# EasyEDA Pro project ch340gv1.eprj

# Schematic CH340GV1
Create Date: 2023-11-12; Page Name: CH340GV1; Project Name: ch340gv1; Schematic Name: CH340GV1; Update Date: 2023-11-13; Company: 嘉立创EDA; Page Size: A4; Version: V1.0
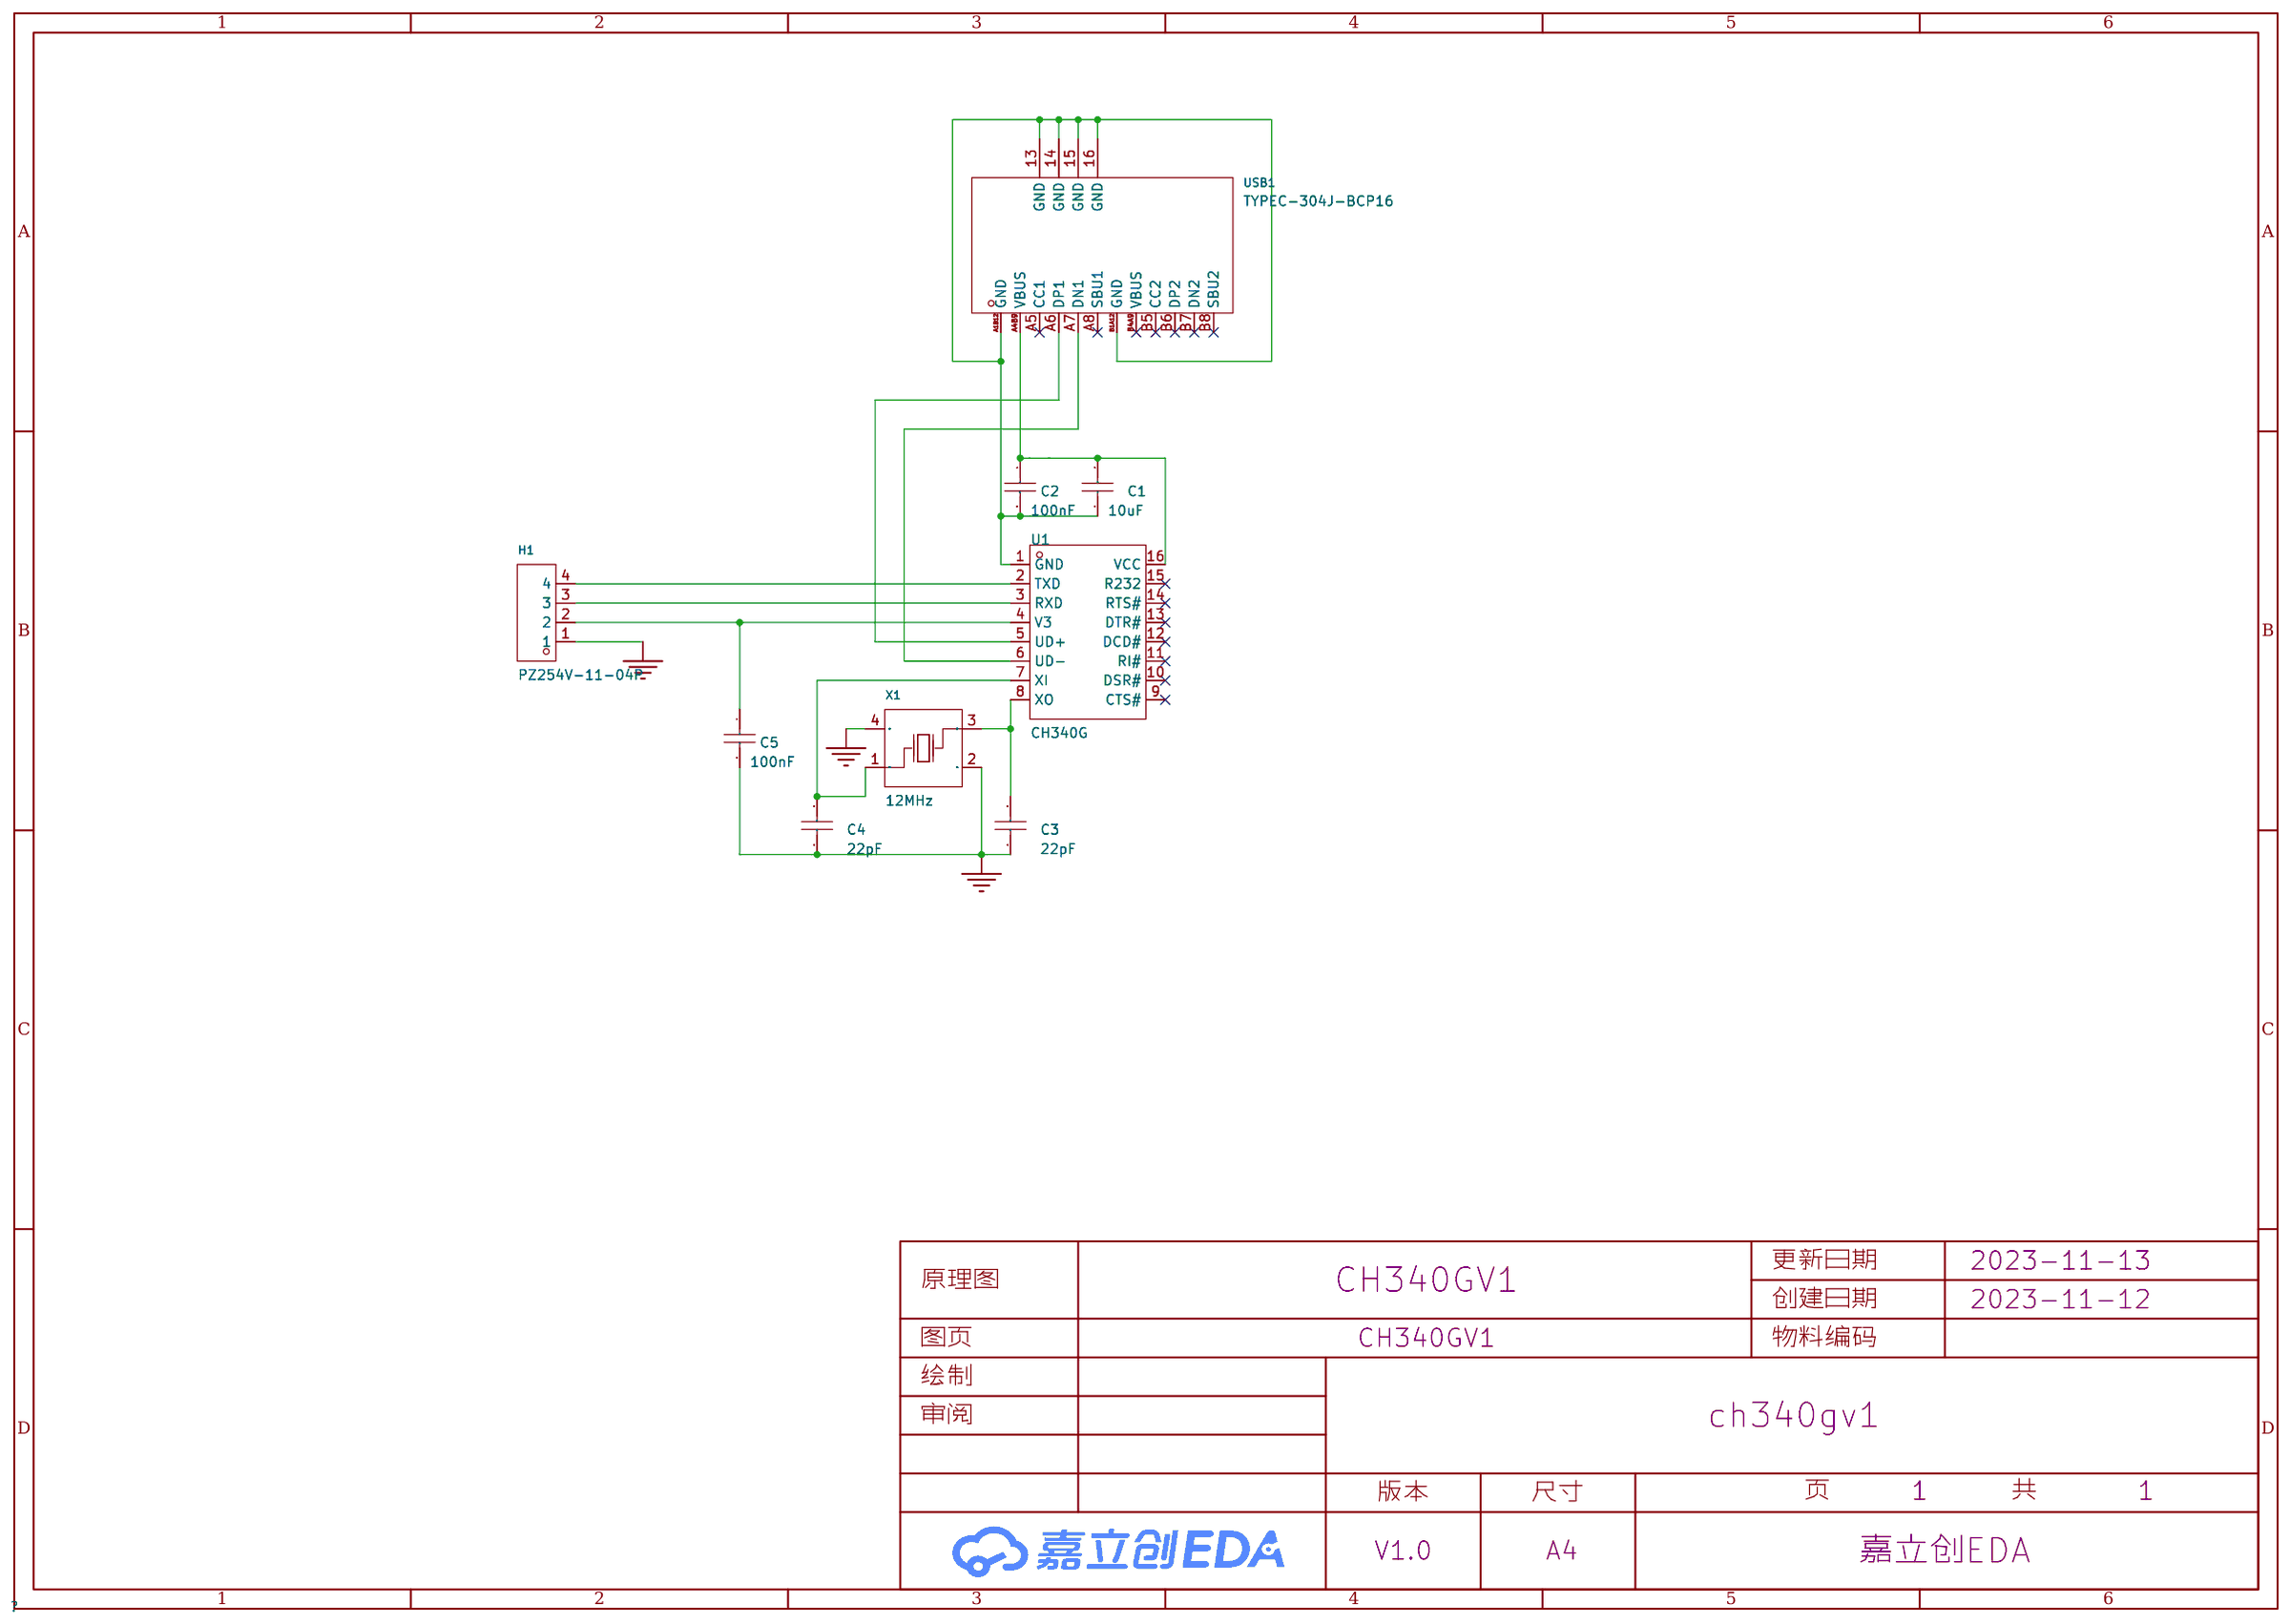
[diagram p0: schematic sheet]

## Parts
C1  10uF  [C1206]
C2  100nF  [C0603]
C3  22pF  [C0603]
C4  22pF  [C0603]
C5  100nF  [C0603]
H1  PZ254V-11-04P  [HDR-TH_4P-P2.54-V-M]
U1  CH340G  [SOIC-16_L9.9-W3.9-P1.27-LS6.0-BL]
USB1  TYPEC-304J-BCP16  [USB-C-SMD_TYPEC-304J-BCP16]
X1  12MHz  [CRYSTAL-SMD_4P-L3.2-W2.5-BL]

## Library data of the parts
C1 = CL31A106KBHNNNE: 容值:10uF;精度:±10%;额定电压:50V;材质(温度系数):X5R;; LCSC Part Name: 10uF ±10% 50V; Supplier Part: C13585; Manufacturer: SAMSUNG(三星); Supplier Footprint: 1206; JLCPCB Part Class: 基础库; Datasheet: https://atta.szlcsc.com/upload/public/pdf/source/20160103/1457707668742.pdf; Supplier: LCSC; Tolerance: ±10%; Voltage Rated: 50V; Temperature Coefficient: X5R
C2 C5 = 0603B104K500NT: 容值:100nF;精度:±10%;额定电压:50V;材质(温度系数):X7R;; LCSC Part Name: 100nF ±10% 50V; Supplier Part: C30926; Manufacturer: FH(风华); Supplier Footprint: 0603; JLCPCB Part Class: 扩展库; Datasheet: https://atta.szlcsc.com/upload/public/pdf/source/20170923/C30926_1506149436298988724.pdf; Supplier: LCSC; Tolerance: ±10%; Voltage Rated: 50V; Temperature Coefficient: X7R
C3 C4 = CC0603JRNPO9BN220: 容值:22pF;精度:±5%;额定电压:50V;材质(温度系数):NP0;; LCSC Part Name: 22pF ±5% 50V; Supplier Part: C105620; Manufacturer: YAGEO(国巨); Supplier Footprint: 0603; JLCPCB Part Class: 扩展库; Datasheet: https://atta.szlcsc.com/upload/public/pdf/source/20170425/1493115771353.pdf; Supplier: LCSC; Tolerance: ±5%; Voltage Rated: 50V; Temperature Coefficient: NP0
H1 = PZ254V-11-04P: 排数:单排;总PIN位数:4P;间距:2.54mm;插针结构:1x4P;行距:-;安装类型:直插;圆针/方针:方针;额定电流:3A;额定电压:250V;配合针长度:6mm;塑高:2.5mm;端接针长度:3mm;触头材质:-;工作温度范围:-40℃~+105℃;颜色:黑色;; LCSC Part Name: 2.54mm 1x4P 直插 方针; Supplier Part: C2691448; Manufacturer: XFCN(兴飞); Supplier Footprint: 插件,P=2.54mm; JLCPCB Part Class: 扩展库; Datasheet: https://atta.szlcsc.com/upload/public/pdf/source/20200309/C492403_F9F19131791D08044AD4F84F8E751A34.pdf; Supplier: LCSC; Number of Rows: 单排; Number of Pins: 4P; Pitch: 2.54mm; Pin Structure: 1x4P; Mounting Type: 直插; Circluar Pins/Square Pins: 方针; Current Rating (Max): 3A; Voltage Rating (Max): 250V; Length of Mating Pin: 6mm; Insulation Height: 2.5mm; Length of End Connection Pin: 3mm; Operating Temperature Range: -40℃~+105℃; Color: 黑色
U1 = CH340G: 应用功能:收发器;接口协议:USB 2.0;数据速率:2Mbps;; LCSC Part Name: USB转串口芯片 CH340; Supplier Part: C14267; Manufacturer: WCH(南京沁恒); Supplier Footprint: SOP-16; JLCPCB Part Class: 扩展库; Datasheet: https://atta.szlcsc.com/upload/public/pdf/source/20230530/6E401E9554E9F5311886CC8B3F89B62E.pdf; Supplier: LCSC; Applications Function: 收发器; Protocol: USB 2.0; Data Rate: 2Mbps; Supply Voltage: 3.3V；5V
USB1 = TYPEC-304J-BCP16: 连接器类型:Type-C;标准:USB 3.1;公母:母座;触点数量:16;端口数量:1;安装方式:卧贴;额定电流 - 电源:5A;工作温度范围:-40℃~+85℃;焊接温度(最大值):260℃;; LCSC Part Name: Type-C 母座 卧贴 脚长2.0; Supplier Part: C2835315; Manufacturer: XUNPU(讯普); Supplier Footprint: SMD,8.94x7.35x3.16mm; JLCPCB Part Class: 扩展库; Supplier: LCSC; Connector Type: Type-C; Standard: USB 3.1; Gender: 母座; Number of Contacts: 16; Number of Ports: 1; Mounting Style: 卧贴; Current Rating - Power (Max): 5A; Operating Temperature Range: -40℃~+85℃; Welding Temperature (Max): 260℃
X1 = TAXM12M4RLBDDT2T: 频率:12MHz;频率公差:±10ppm;负载电容:20pF;; LCSC Part Name: 12MHz ±10ppm 20pF; Supplier Part: C133334; Manufacturer: TAE(雅晶鑫); Supplier Footprint: SMD3225-4P; JLCPCB Part Class: 扩展库; Datasheet: https://atta.szlcsc.com/upload/public/pdf/source/20210910/A862C74DCD1FE9853DDB17F72A491972.pdf; Supplier: LCSC; Crystal Type: 贴片无源晶振; Frequency Tolerance: ±10ppm; Frequency Stability: ±20ppm; Load Capacitance: 20pF; Equivalent Series Resistance (ESR): 50Ω; Operating Temperature: -30℃~+85℃

## Nets
GND: C3.2 C4.2 C5.2 H1.1 X1.2(GND) X1.4(GND)
$1N386: C1.2 C2.1 U1.16(VCC) USB1.A4B9(VBUS)
$1N793: C4.1 U1.7(XI) X1.1(OSC1)
$1N927: C3.1 U1.8(XO) X1.3(OSC2)
$1N1103: H1.4 U1.2(TXD)
$1N1106: H1.3 U1.3(RXD)
$1N1109: U1.5(UD+) USB1.A6(DP1)
$1N1115: U1.6(UD-) USB1.A7(DN1)
$1N1172: C5.1 H1.2 U1.4(V3)
$1N1524: C1.1 C2.2 U1.1(GND) USB1.13(GND) USB1.14(GND) USB1.15(GND) USB1.16(GND) USB1.A1B12(GND) USB1.B1A12(GND)

Not connected (* = marked no-connect by the designer): U1 9(CTS#)* 10(DSR#)* 11(RI#)* 12(DCD#)* 13(DTR#)* 14(RTS#)* 15(R232)*; USB1 A5(CC1)* A8(SBU1)* B4A9(VBUS)* B5(CC2)* B6(DP2)* B7(DN2)* B8(SBU2)*

# Schematic CH340G2
Create Date: 2023-12-14; Page Name: CH340G2; Project Name: ch340gv1; Schematic Name: CH340G2; Update Date: 2023-12-15; Company: 嘉立创EDA; Page Size: A4; Version: V1.0
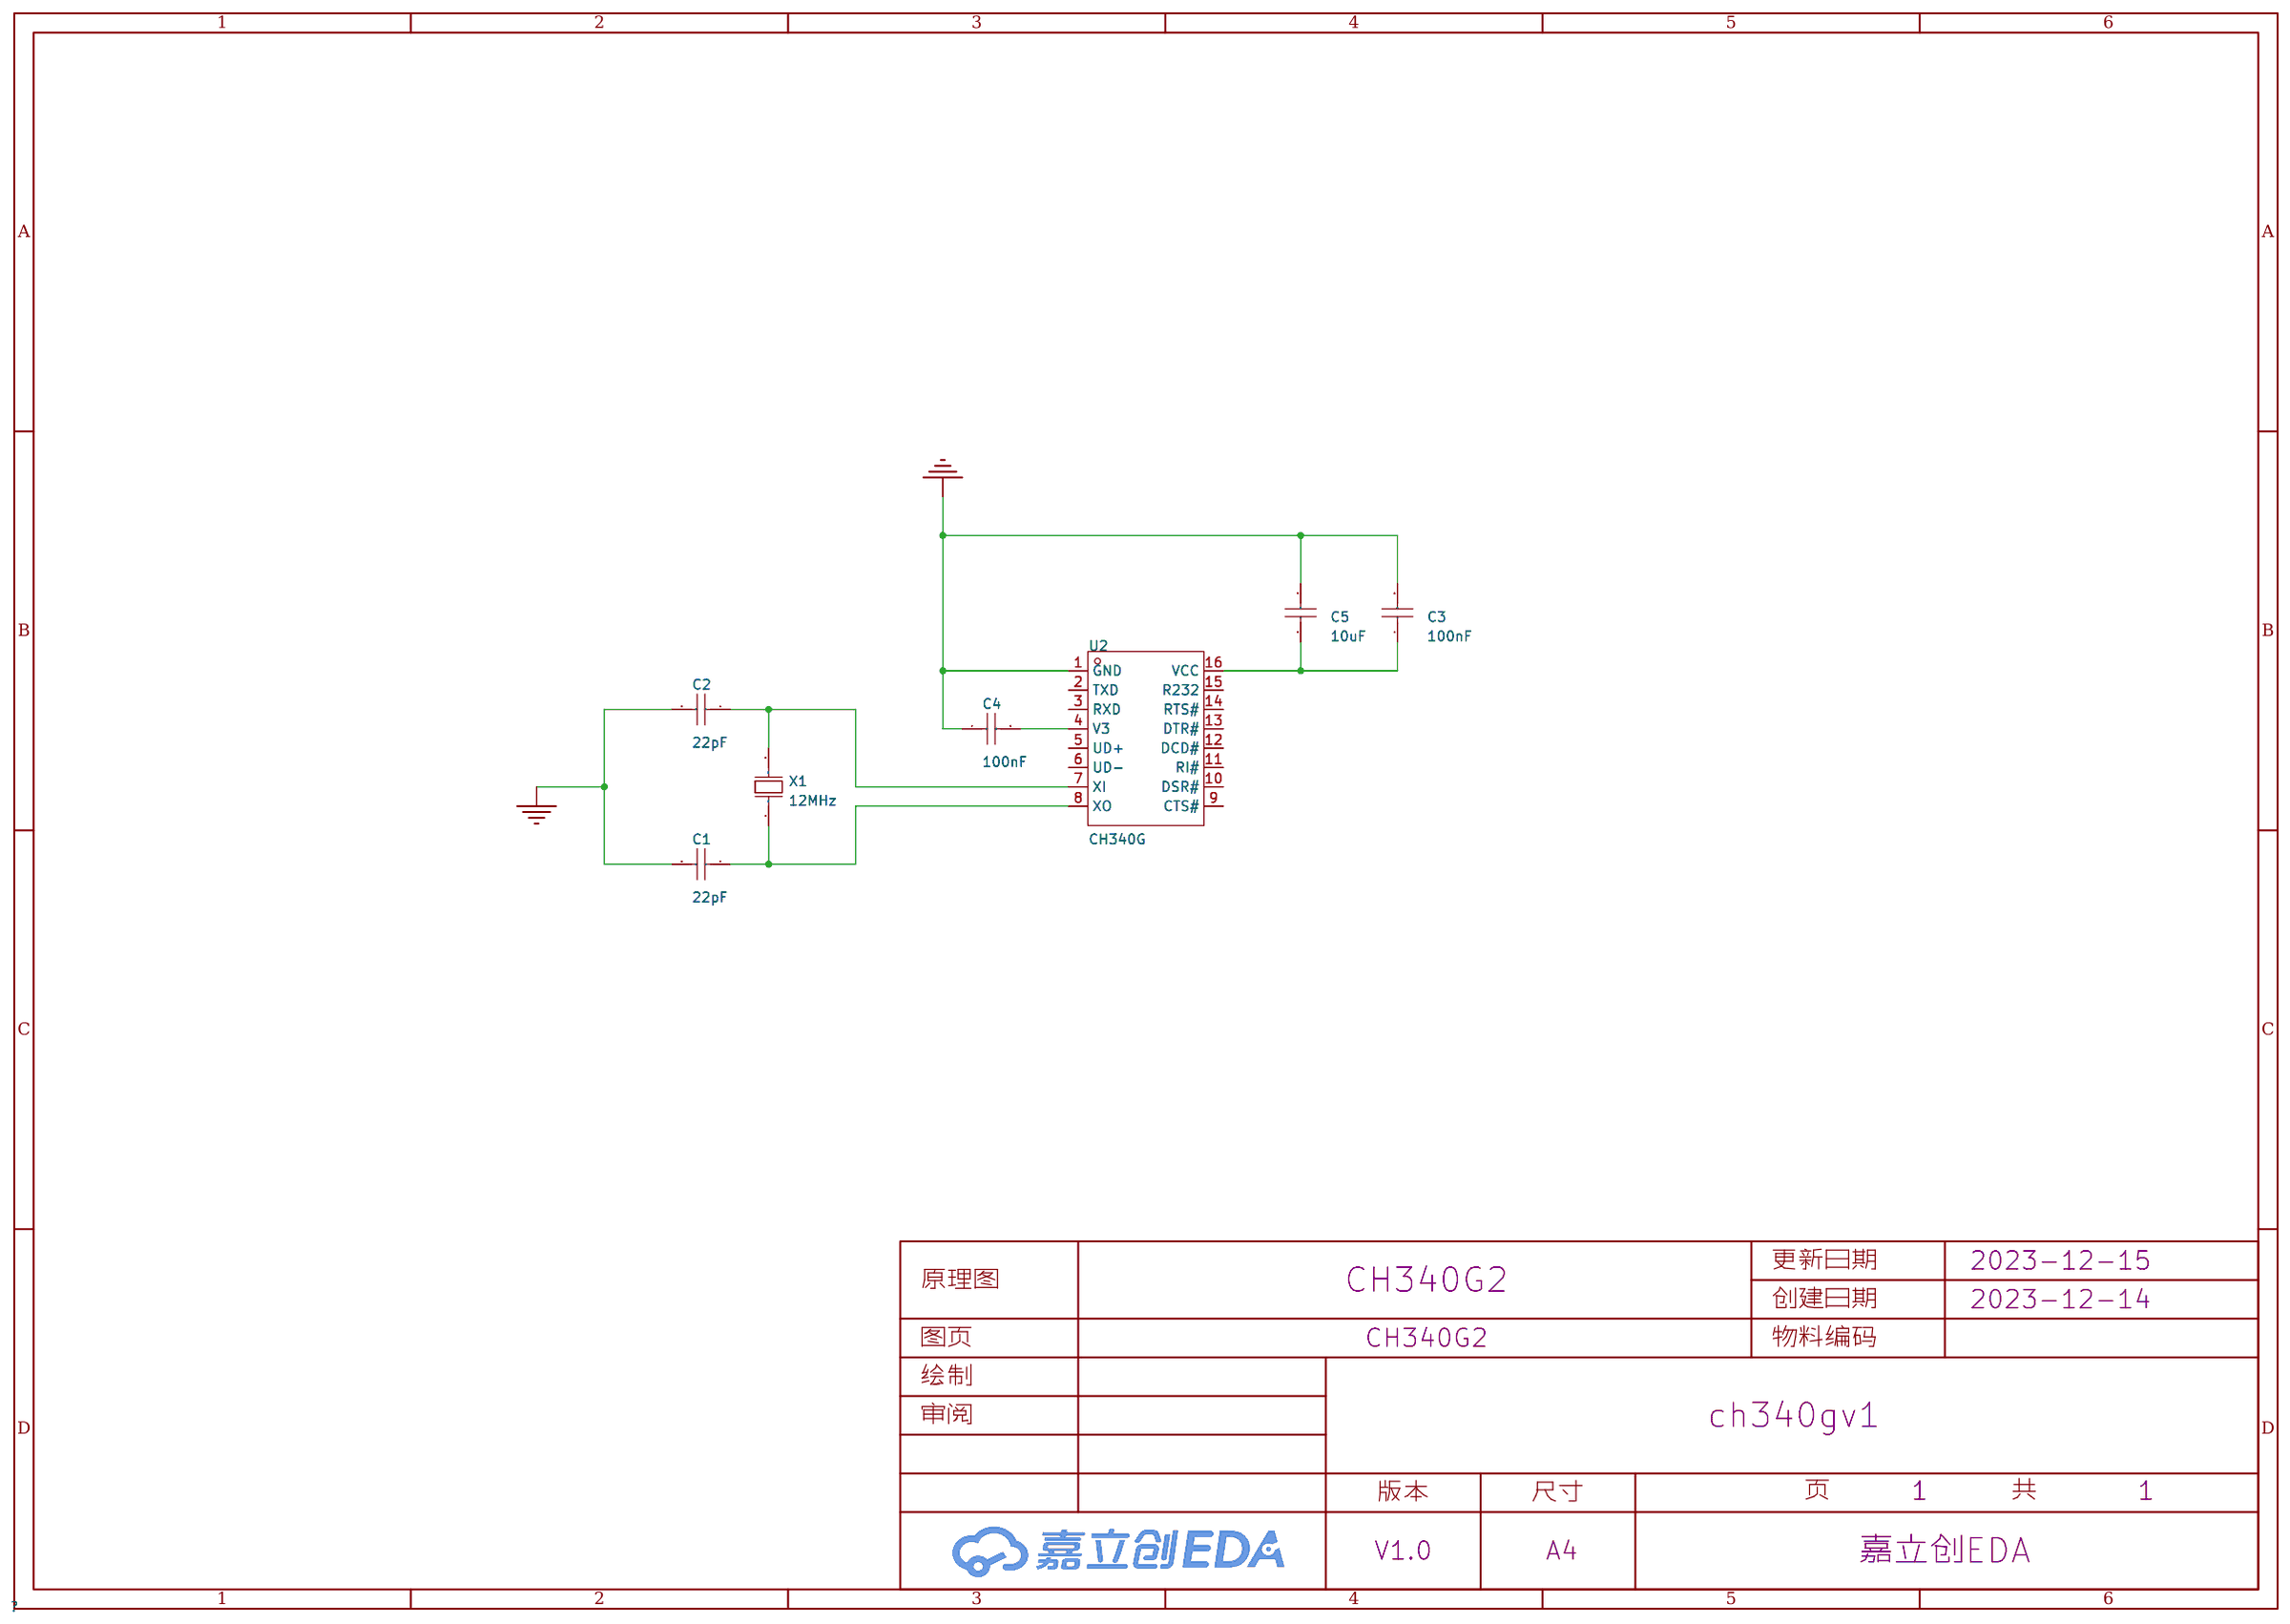
[diagram p1: schematic sheet]

## Parts
C1  22pF  [C0603]
C2  22pF  [C0603]
C3  100nF  [C0603]
C4  100nF  [C0603]
C5  10uF  [C0805]
U2  CH340G  [SOIC-16_L9.9-W3.9-P1.27-LS6.0-BL]
X1  12MHz  [CRYSTAL-SMD_L11.4-W4.7-LS12.7]

## Library data of the parts
C1 C2 = CC0603JRNPO9BN220: 容值:22pF;精度:±5%;额定电压:50V;材质(温度系数):NP0;; LCSC Part Name: 22pF ±5% 50V; Supplier Part: C105620; Manufacturer: YAGEO(国巨); Supplier Footprint: 0603; JLCPCB Part Class: 扩展库; Datasheet: https://atta.szlcsc.com/upload/public/pdf/source/20170505/1493957838062.pdf; Supplier: LCSC; Tolerance: ±5%; Voltage Rated: 50V; Temperature Coefficient: NP0
C3 C4 = 0603B104K500NT: 容值:100nF;精度:±10%;额定电压:50V;材质(温度系数):X7R;; LCSC Part Name: 100nF ±10% 50V; Supplier Part: C30926; Manufacturer: FH(风华); Supplier Footprint: 0603; JLCPCB Part Class: 扩展库; Datasheet: https://atta.szlcsc.com/upload/public/pdf/source/20200305/C486355_26A10D38EF8C2A5C37091D0039909270.pdf; Supplier: LCSC; Tolerance: ±10%; Voltage Rated: 50V; Temperature Coefficient: X7R
C5 = CL21A106KAYNNNE_C15850: 容值:10uF;精度:±10%;额定电压:25V;材质(温度系数):X5R;; LCSC Part Name: 10uF ±10% 25V; Supplier Part: C15850; Manufacturer: SAMSUNG(三星); Manufacturer Part: CL21A106KAYNNNE; Supplier Footprint: 0805; JLCPCB Part Class: 基础库; Datasheet: https://atta.szlcsc.com/upload/public/pdf/source/20160103/1457707679302.pdf; Supplier: LCSC; Tolerance: ±10%; Voltage Rated: 25V; Temperature Coefficient: X5R
U2 = CH340G: 应用功能:收发器;接口协议:USB 2.0;数据速率:2Mbps;; LCSC Part Name: USB转串口芯片 CH340; Supplier Part: C14267; Manufacturer: WCH(南京沁恒); Supplier Footprint: SOP-16; JLCPCB Part Class: 扩展库; Datasheet: https://atta.szlcsc.com/upload/public/pdf/source/20230530/6E401E9554E9F5311886CC8B3F89B62E.pdf; Supplier: LCSC; Applications Function: 收发器; Protocol: USB 2.0; Data Rate: 2Mbps; Supply Voltage: 3.3V；5V
X1 = X49SS2-8.000-F20JGDT: 频率:8MHz;负载电容:20pF;频率公差:±30ppm;; LCSC Part Name: 8MHz ±30ppm 20pF; Supplier Part: C2842263; Manufacturer: HCI(杭晶); Supplier Footprint: HC-49SMD; JLCPCB Part Class: 扩展库; Datasheet: https://atta.szlcsc.com/upload/public/pdf/source/20220525/41AB7615A6CBF59B0A628FE584B63957.pdf; Supplier: LCSC; Crystal Type: 49SMD; Load Capacitance: 20pF; Frequency Tolerance: ±30ppm; Frequency Stability: ±50ppm; Operating Temperature: -40℃~+85℃

## Nets
GND: C1.2 C2.2 C3.2 C4.1 C5.2 U2.1(GND)
Net-(C1-1): C1.1 U2.8(XO) X1.1(OSC1)
Net-(C2-1): C2.1 U2.7(XI) X1.2(OSC2)
Net-(C3-1): C3.1 C5.1 U2.16(VCC)
Net-(C4-2): C4.2 U2.4(V3)

Not connected (* = marked no-connect by the designer): U2 2(TXD) 3(RXD) 5(UD+) 6(UD-) 9(CTS#) 10(DSR#) 11(RI#) 12(DCD#) 13(DTR#) 14(RTS#) 15(R232)

# Schematic CH340G3
Create Date: 2024-03-13; Page Name: P1; Project Name: ch340gv1; Schematic Name: CH340G3; Update Date: 2024-03-14; Company: 嘉立创EDA; Page Size: A4; Version: V1.0
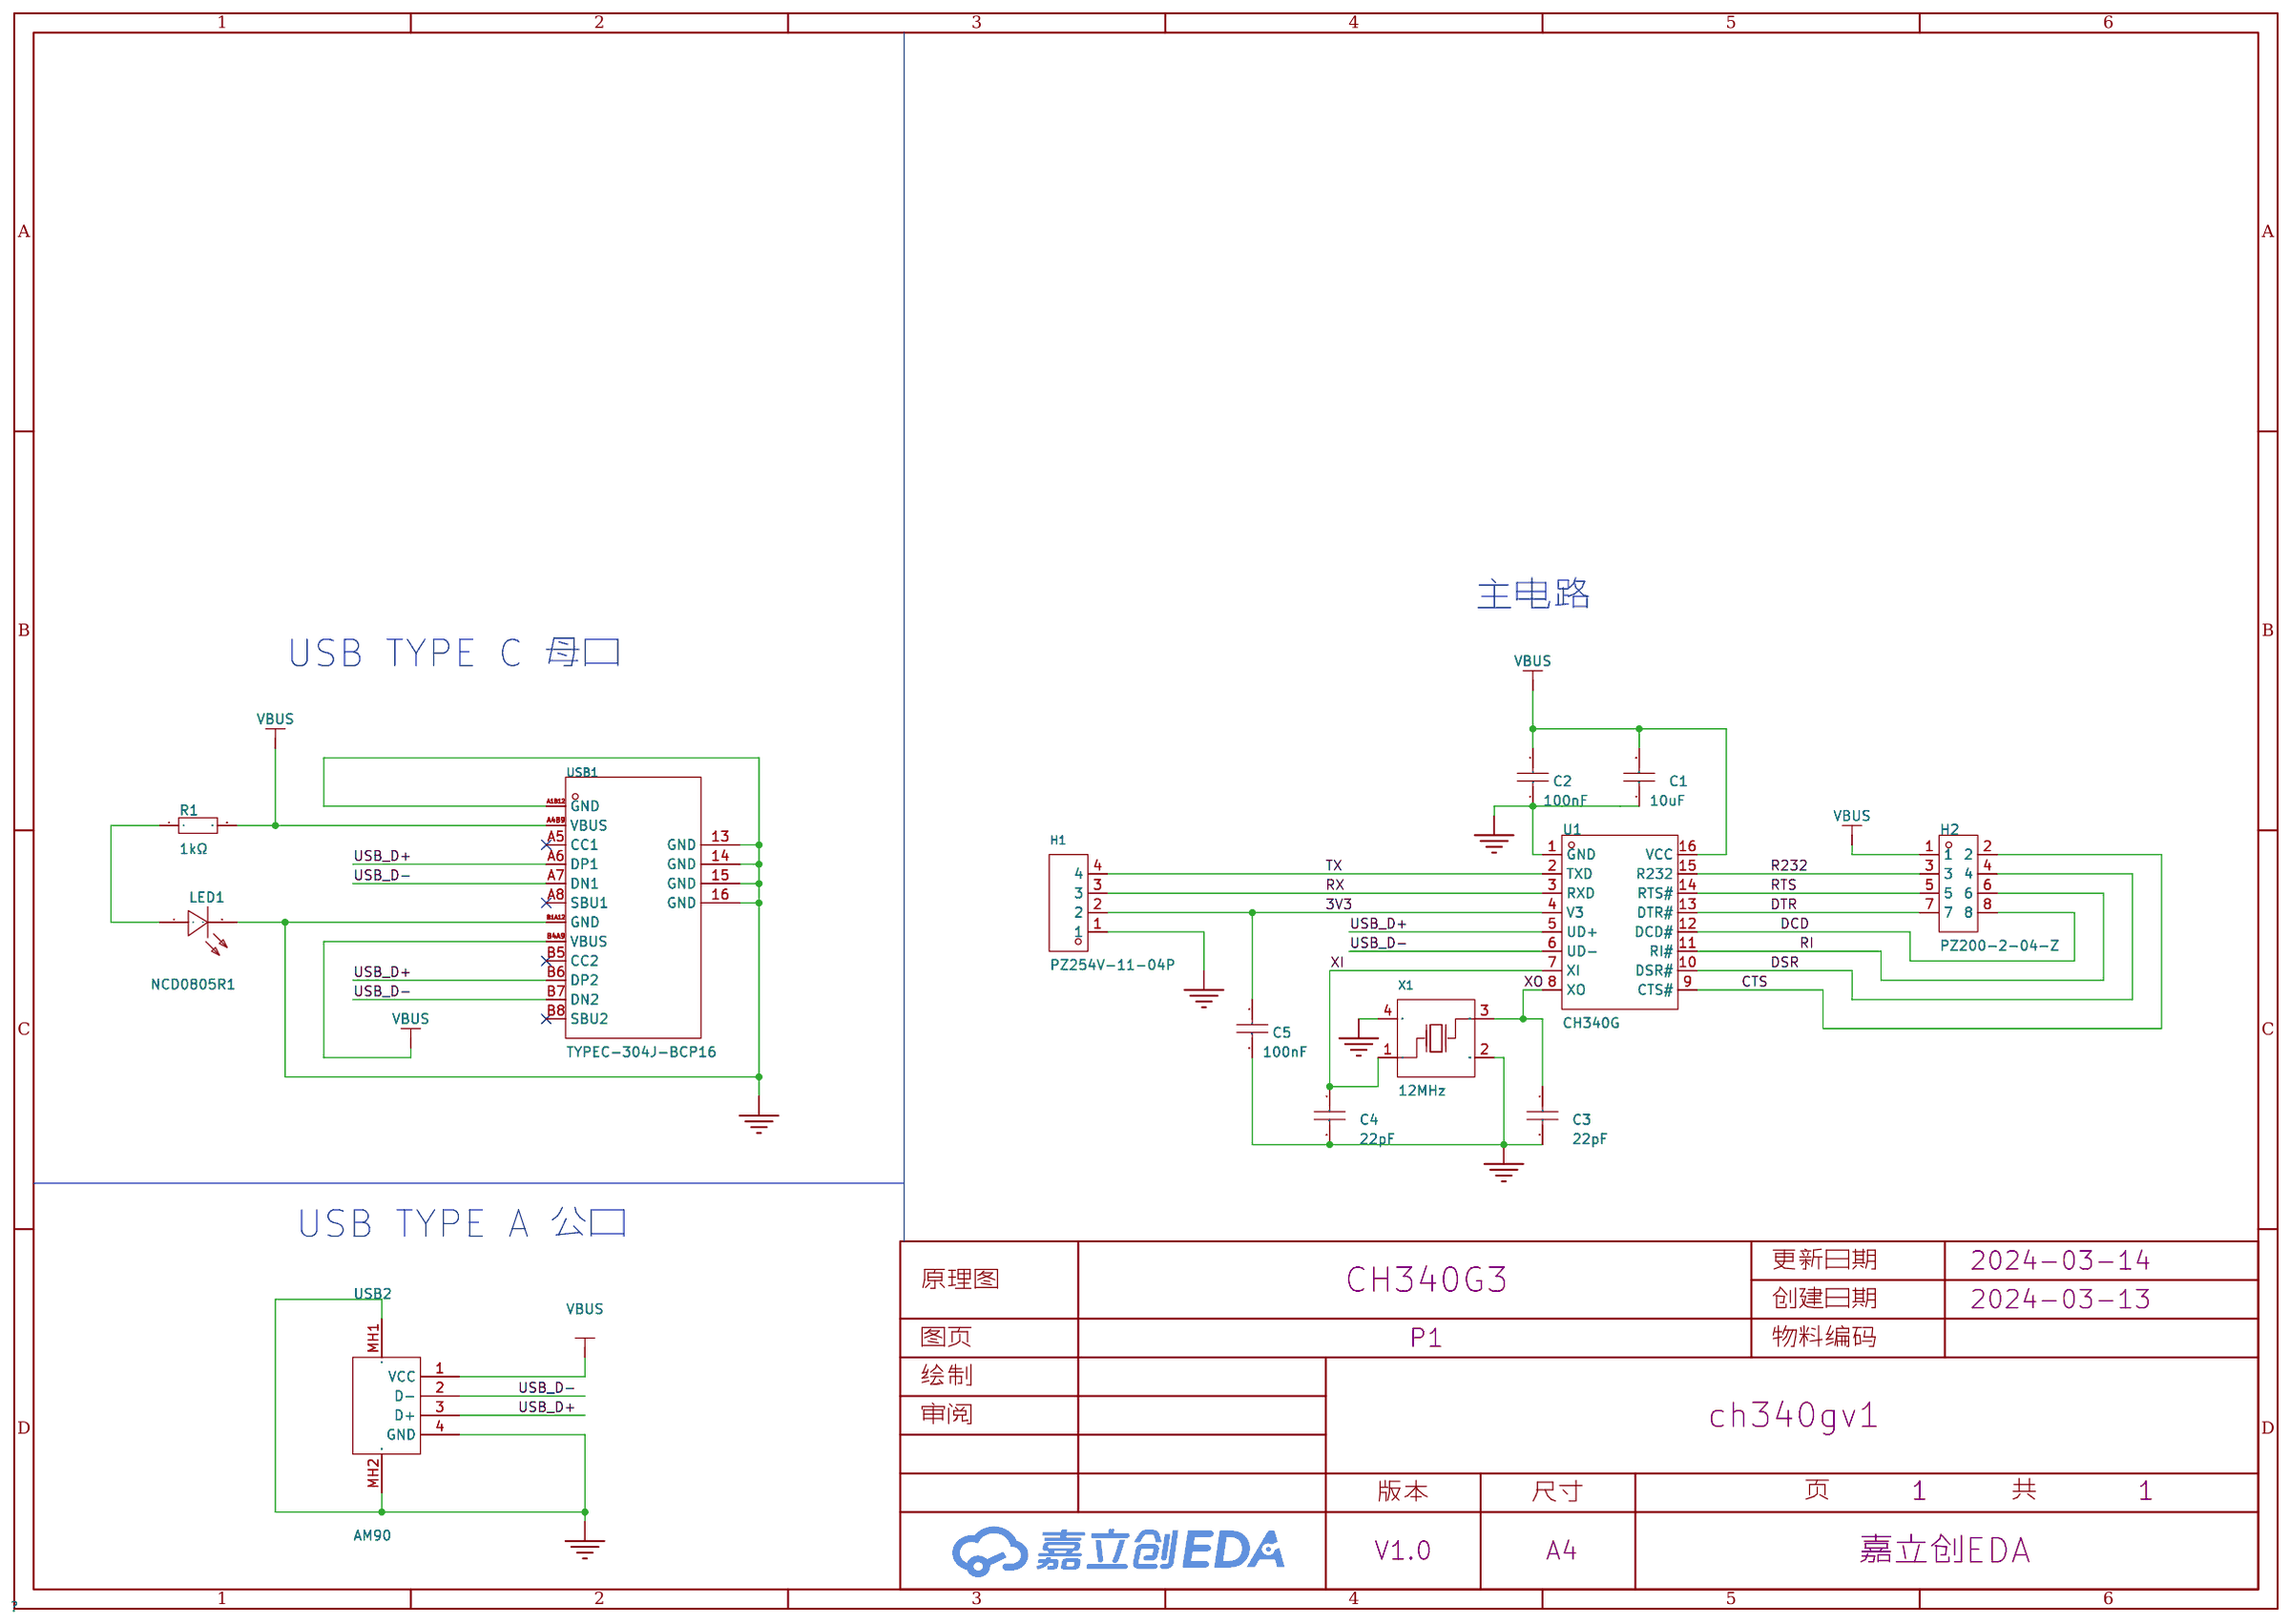
[diagram p2: schematic sheet]

## Parts
C1  10uF  [C1206]
C2  100nF  [C0603]
C3  22pF  [C0603]
C4  22pF  [C0603]
C5  100nF  [C0603]
H1  PZ254V-11-04P  [HDR-TH_4P-P2.54-V-M]
H2  PZ200-2-04-Z  [HDR-TH_8P-P2.00-V-M-R2-C4-S2.00]
LED1  NCD0805R1  [LED0805-R-RD]
R1  1kΩ  [R0603]
U1  CH340G  [SOIC-16_L9.9-W3.9-P1.27-LS6.0-BL]
USB1  TYPEC-304J-BCP16  [USB-C-SMD_TYPEC-304J-BCP16]
USB2  AM90  [USB-AM-TH_AM90]
X1  12MHz  [CRYSTAL-SMD_4P-L3.2-W2.5-BL]

## Library data of the parts
C1 = CL31A106KBHNNNE: 容值:10uF;精度:±10%;额定电压:50V;材质(温度系数):X5R;; LCSC Part Name: 10uF ±10% 50V; Supplier Part: C13585; Manufacturer: SAMSUNG(三星); Supplier Footprint: 1206; JLCPCB Part Class: 基础库; Datasheet: https://atta.szlcsc.com/upload/public/pdf/source/20160103/1457707668742.pdf; Supplier: LCSC; Tolerance: ±10%; Voltage Rated: 50V; Temperature Coefficient: X5R
C2 C5 = 0603B104K500NT: 容值:100nF;精度:±10%;额定电压:50V;材质(温度系数):X7R;; LCSC Part Name: 100nF ±10% 50V; Supplier Part: C30926; Manufacturer: FH(风华); Supplier Footprint: 0603; JLCPCB Part Class: 扩展库; Datasheet: https://atta.szlcsc.com/upload/public/pdf/source/20170923/C30926_1506149436298988724.pdf; Supplier: LCSC; Tolerance: ±10%; Voltage Rated: 50V; Temperature Coefficient: X7R
C3 C4 = CC0603JRNPO9BN220: 容值:22pF;精度:±5%;额定电压:50V;材质(温度系数):NP0;; LCSC Part Name: 22pF ±5% 50V; Supplier Part: C105620; Manufacturer: YAGEO(国巨); Supplier Footprint: 0603; JLCPCB Part Class: 扩展库; Datasheet: https://atta.szlcsc.com/upload/public/pdf/source/20170425/1493115771353.pdf; Supplier: LCSC; Tolerance: ±5%; Voltage Rated: 50V; Temperature Coefficient: NP0
H1 = PZ254V-11-04P: 排数:单排;总PIN位数:4P;间距:2.54mm;插针结构:1x4P;行距:-;安装类型:直插;圆针/方针:方针;额定电流:3A;额定电压:250V;配合针长度:6mm;塑高:2.5mm;端接针长度:3mm;触头材质:-;工作温度范围:-40℃~+105℃;颜色:黑色;; LCSC Part Name: 2.54mm 1x4P 直插 方针; Supplier Part: C2691448; Manufacturer: XFCN(兴飞); Supplier Footprint: 插件,P=2.54mm; JLCPCB Part Class: 扩展库; Datasheet: https://atta.szlcsc.com/upload/public/pdf/source/20200309/C492403_F9F19131791D08044AD4F84F8E751A34.pdf; Supplier: LCSC; Number of Rows: 单排; Number of Pins: 4P; Pitch: 2.54mm; Pin Structure: 1x4P; Mounting Type: 直插; Circluar Pins/Square Pins: 方针; Current Rating (Max): 3A; Voltage Rating (Max): 250V; Length of Mating Pin: 6mm; Insulation Height: 2.5mm; Length of End Connection Pin: 3mm; Operating Temperature Range: -40℃~+105℃; Color: 黑色
H2 = PZ200-2-04-Z: 插针结构:2x4P;间距:2mm;行距:2mm;圆针/方针:方针;安装类型:直插;排数:双排;总PIN位数:8P;额定电流:1.5A;额定电压:-;配合针长度:4mm;塑高:2mm;端接针长度:2.8mm;触头材质:黄铜;工作温度范围:-40℃~+105℃;焊接温度(最大值):260℃@5S;颜色:黑色;; LCSC Part Name: 2x4P 间距:2mm 方针 直插; Supplier Part: C2905990; Manufacturer: HCTL(华灿天禄); Supplier Footprint: 插件,P=2mm; JLCPCB Part Class: 扩展库; Datasheet: https://atta.szlcsc.com/upload/public/pdf/source/20230609/E9B292E9F4F82C2859D5665FE1B563FB.pdf; Supplier: LCSC; Pin Structure: 2x4P; Pitch: 2mm; Row Spacing: 2mm; Circluar Pins/Square Pins: 方针; Mounting Type: 直插; Number of Rows: 双排; Number of Pins: 8P; Current Rating (Max): 1.5A; Length of Mating Pin: 4mm; Insulation Height: 2mm; Length of End Connection Pin: 2.8mm; Contact Material: 黄铜; Operating Temperature Range: -40℃~+105℃; Soldering Temperature(Max): 260℃@5S; Color: 黑色
LED1 = NCD0805R1: 灯头类型:-;发光颜色:红色;正向电压(VF):1.6V~2.6V;功率:65mW;正向电流:20mA;主波长:615nm~630nm;二极管配置:独立二极管;透镜颜色:无色透明透镜;色温:-;发光强度:67mcd~195mcd;发光角度:130°;载带方式:-;工作温度:-30℃~+85℃;; Supplier Part: C84256; Manufacturer: 国星光电; Supplier Footprint: 0805; JLCPCB Part Class: 基础库; Datasheet: https://atta.szlcsc.com/upload/public/pdf/source/20200820/C84256_F0A75A43B3EAD75808600A0514C76B99.pdf; Supplier: LCSC; Emitted Color: 红色; Forward Voltage (VF): 1.6V~2.6V; Power Dissipation: 65mW; Forward Current: 20mA; Dominant Wavelength: 615nm~630nm; Diode Configuration: 独立二极管; Lens Color: 无色透明透镜; Luminous Intensity: 67mcd~195mcd; Viewing Angle: 130°; Operating Temperature: -30℃~+85℃
R1 = 0603WAF1001T5E: 电阻类型:厚膜电阻;阻值:1kΩ;精度:±1%;功率:100mW;最大工作电压:75V;温度系数:±100ppm/℃;; LCSC Part Name: 1kΩ ±1% 100mW 厚膜电阻; Supplier Part: C21190; Manufacturer: UNI-ROYAL(厚声); Supplier Footprint: 0603; JLCPCB Part Class: 基础库; Datasheet: https://atta.szlcsc.com/upload/public/pdf/source/20200306/C422600_1E6D84923E4A46A82E41ADD87F860B5C.pdf; Supplier: LCSC; Type: 厚膜电阻; Tolerance: ±1%; Power(Watts): 100mW; Overload Voltage (Max): 75V; Temperature Coefficient: ±100ppm/℃; Operating Temperature Range: -55℃~+155℃
U1 = CH340G: 应用功能:收发器;接口协议:USB 2.0;数据速率:2Mbps;; LCSC Part Name: USB转串口芯片 CH340; Supplier Part: C14267; Manufacturer: WCH(南京沁恒); Supplier Footprint: SOP-16; JLCPCB Part Class: 扩展库; Datasheet: https://atta.szlcsc.com/upload/public/pdf/source/20230530/6E401E9554E9F5311886CC8B3F89B62E.pdf; Supplier: LCSC; Applications Function: 收发器; Protocol: USB 2.0; Data Rate: 2Mbps; Supply Voltage: 3.3V；5V
USB1 = TYPEC-304J-BCP16: 连接器类型:Type-C;标准:USB 3.1;公母:母座;触点数量:16;端口数量:1;安装方式:卧贴;额定电流 - 电源:5A;工作温度范围:-40℃~+85℃;焊接温度(最大值):260℃;; LCSC Part Name: Type-C 母座 卧贴 脚长2.0; Supplier Part: C2835315; Manufacturer: XUNPU(讯普); Supplier Footprint: SMD,8.94x7.35x3.16mm; JLCPCB Part Class: 扩展库; Supplier: LCSC; Connector Type: Type-C; Standard: USB 3.1; Gender: 母座; Number of Contacts: 16; Number of Ports: 1; Mounting Style: 卧贴; Current Rating - Power (Max): 5A; Operating Temperature Range: -40℃~+85℃; Welding Temperature (Max): 260℃
USB2 = AM90: 连接器类型:Type-A;标准:USB 2.0;公母:公;端口数量:1;触点数量:4P;安装方式:弯插;额定电流 - 电源:-;工作温度范围:-;; LCSC Part Name: Type-A 公 弯插; Supplier Part: C404965; Manufacturer: SHOU HAN(首韩); Supplier Footprint: 插件; JLCPCB Part Class: 扩展库; Datasheet: https://atta.szlcsc.com/upload/public/pdf/source/20190722/C404965_9CC10BE28E3F9E5134758D030387C529.pdf; Supplier: LCSC; Connector Type: Type-A; Standard: USB 2.0; Gender: 公; Number of Ports: 1; Number of Contacts: 4P; Mounting Style: 弯插
X1 = TAXM12M4RLBDDT2T: 频率:12MHz;频率公差:±10ppm;负载电容:20pF;; LCSC Part Name: 12MHz ±10ppm 20pF; Supplier Part: C133334; Manufacturer: TAE(雅晶鑫); Supplier Footprint: SMD3225-4P; JLCPCB Part Class: 扩展库; Datasheet: https://atta.szlcsc.com/upload/public/pdf/source/20210910/A862C74DCD1FE9853DDB17F72A491972.pdf; Supplier: LCSC; Crystal Type: 贴片无源晶振; Frequency Tolerance: ±10ppm; Frequency Stability: ±20ppm; Load Capacitance: 20pF; Equivalent Series Resistance (ESR): 50Ω; Operating Temperature: -30℃~+85℃

## Nets
3V3: C5.1 H1.2 U1.4(V3)
GND: C1.1 C2.2 C3.2 C4.2 C5.2 H1.1 LED1.2(-) U1.1(GND) USB1.13(GND) USB1.14(GND) USB1.15(GND) USB1.16(GND) USB1.A1B12(GND) USB1.B1A12(GND) USB2.4(GND) USB2.MH1 USB2.MH2 X1.2(GND) X1.4(GND)
VBUS: C1.2 C2.1 H2.1 R1.2 U1.16(VCC) USB1.A4B9(VBUS) USB1.B4A9(VBUS) USB2.1(VCC)
CTS: H2.2 U1.9(CTS#)
DCD: H2.8 U1.12(DCD#)
DSR: H2.4 U1.10(DSR#)
DTR: H2.7 U1.13(DTR#)
R232: H2.3 U1.15(R232)
RI: H2.6 U1.11(RI#)
RTS: H2.5 U1.14(RTS#)
RX: H1.3 U1.3(RXD)
TX: H1.4 U1.2(TXD)
USB_D+: U1.5(UD+) USB1.A6(DP1) USB1.B6(DP2) USB2.3(D+)
USB_D-: U1.6(UD-) USB1.A7(DN1) USB1.B7(DN2) USB2.2(D-)
XI: C4.1 U1.7(XI) X1.1(OSC1)
XO: C3.1 U1.8(XO) X1.3(OSC2)
$1N1485: LED1.1(+) R1.1

Not connected (* = marked no-connect by the designer): USB1 A5(CC1)* A8(SBU1)* B5(CC2)* B8(SBU2)*

## Notes on the sheet
- 主电路
- USB TYPE C 母口
- USB TYPE A 公口

# Schematic CH340EV1
Create Date: 2024-05-19; Page Name: P1; Project Name: ch340gv1; Schematic Name: CH340EV1; Update Date: 2024-05-20; Company: 嘉立创EDA; Page Size: A4; Version: V1.0
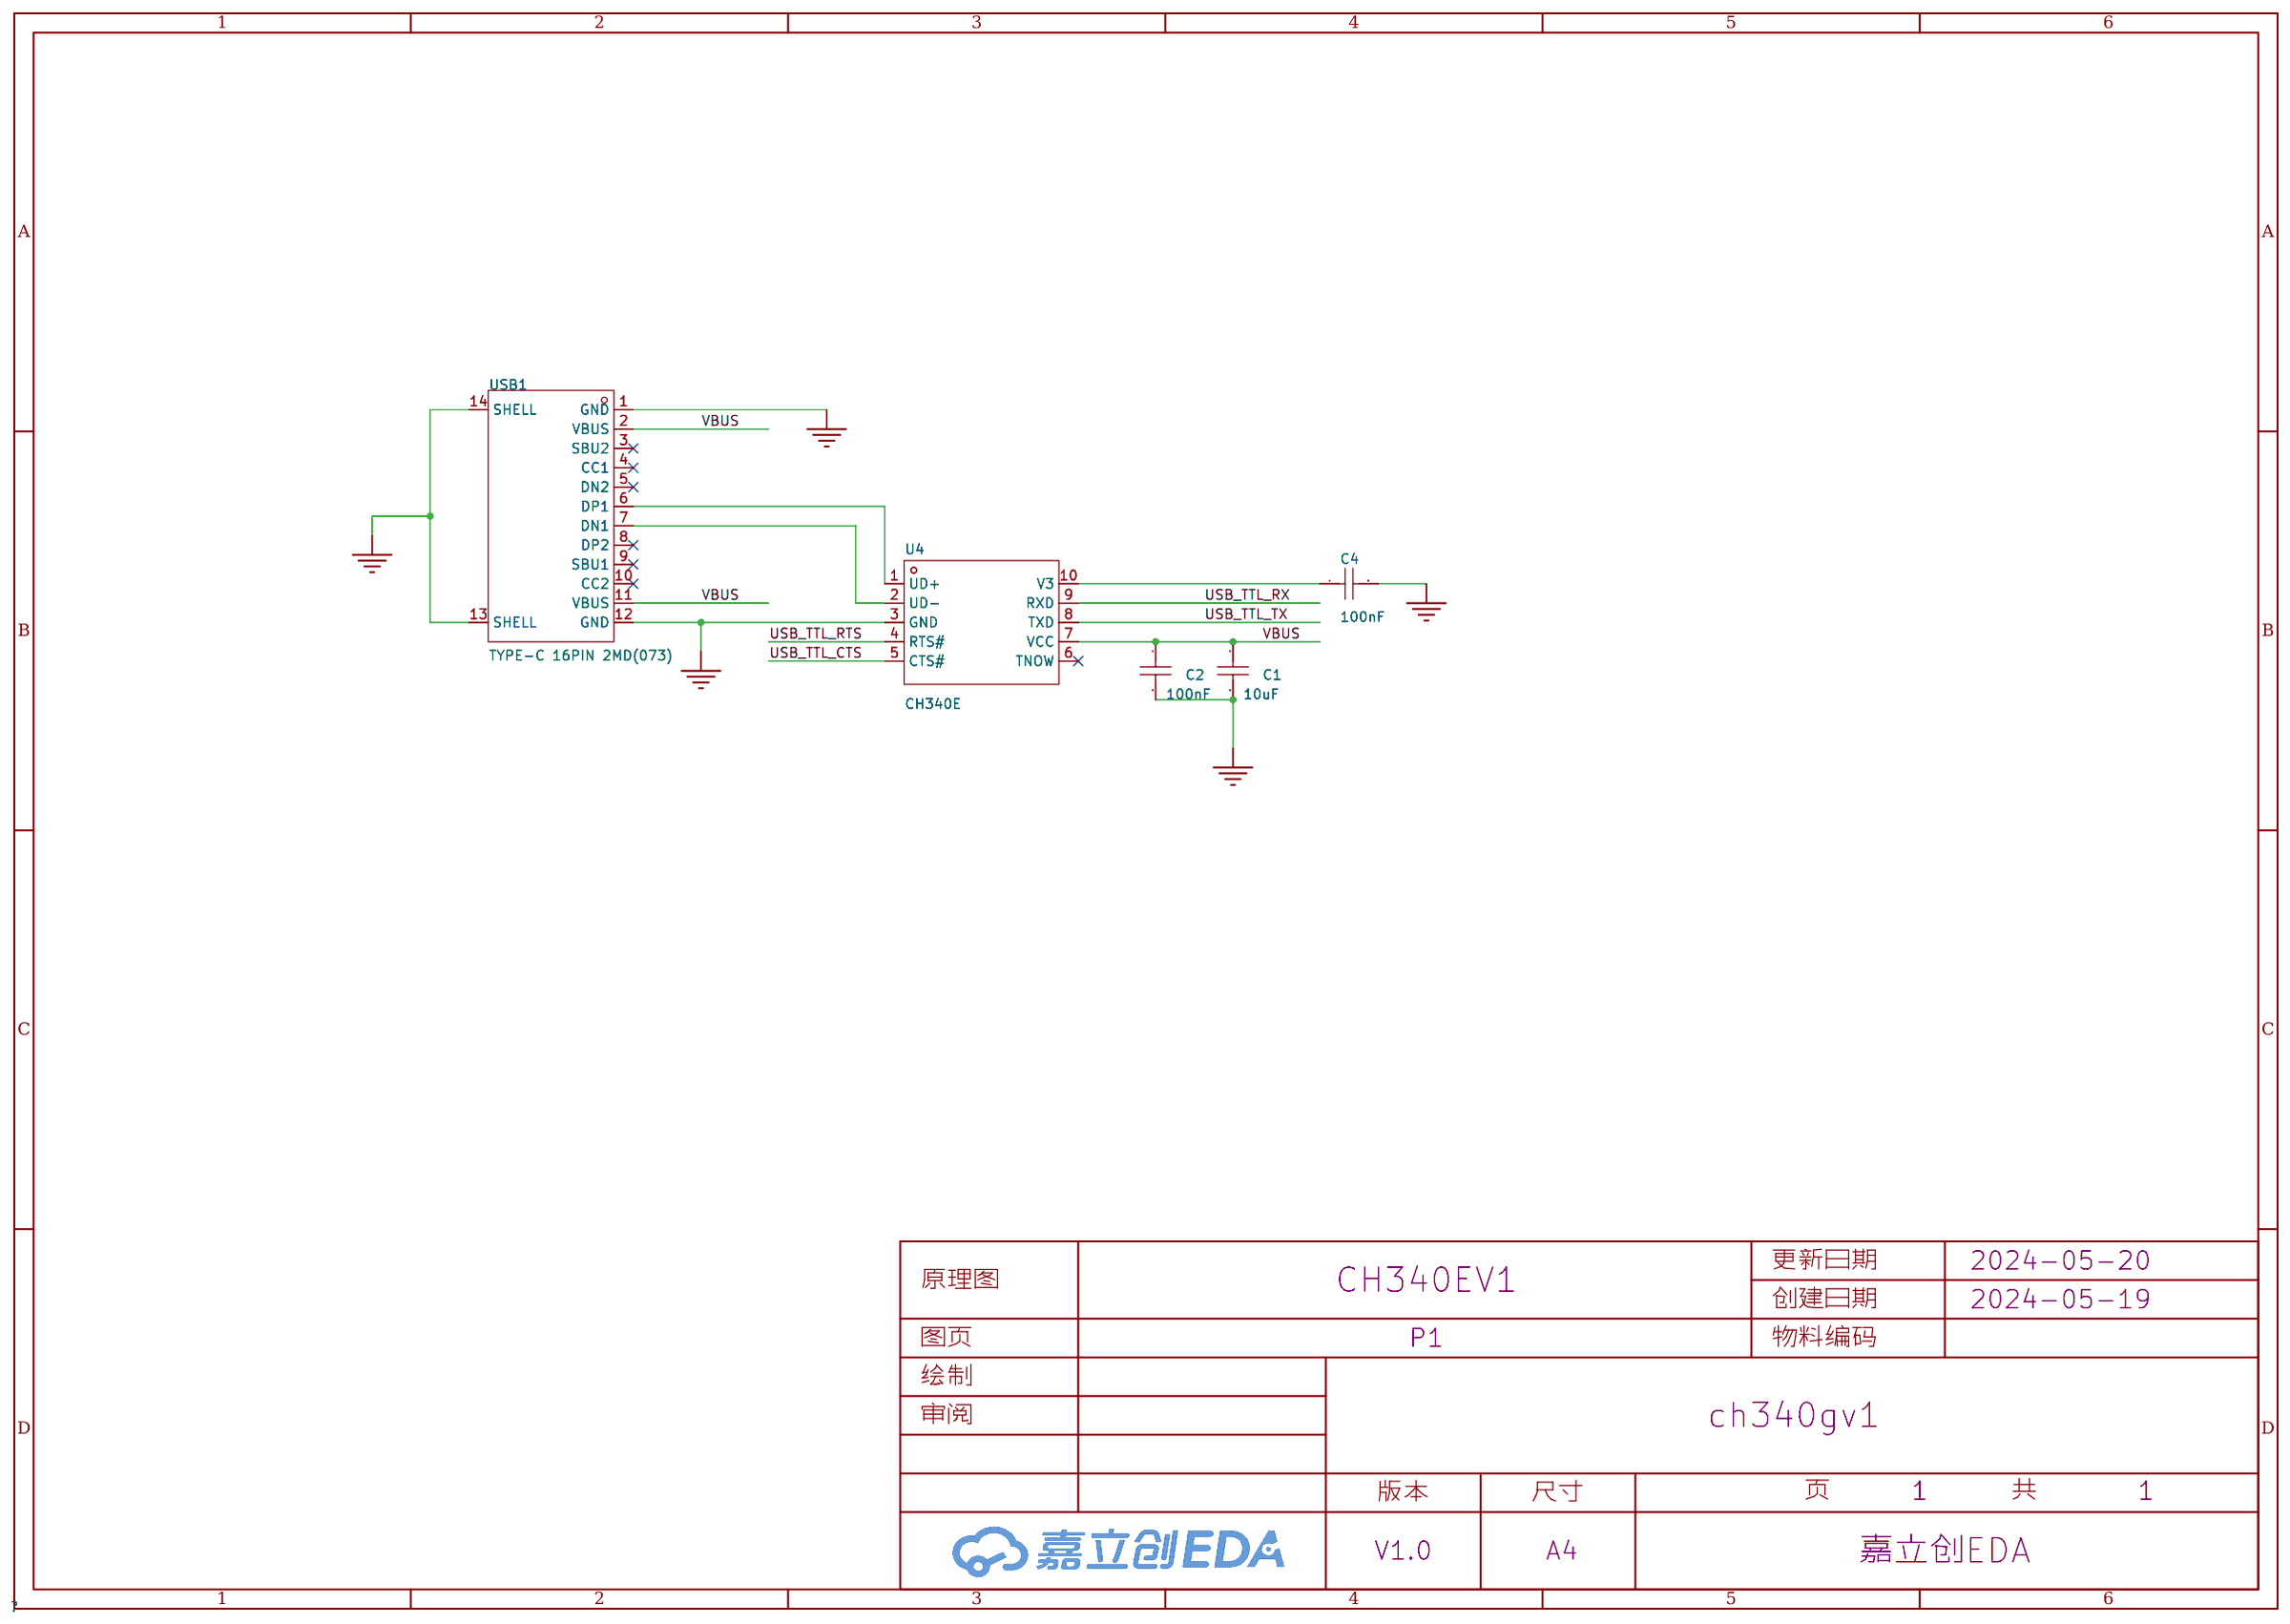
[diagram p3: schematic sheet]

## Parts
C1  10uF  [C1206]
C2  100nF  [C0603]
C4  100nF  [C0603]
U4  CH340E  [MSOP-10_L3.0-W3.0-P0.50-LS5.0-BL]
USB1  TYPE-C 16PIN 2MD(073)  [USB-C-SMD_TYPE-C-6PIN-2MD-073]

## Library data of the parts
C1 = CL31A106KBHNNNE: 容值:10uF;精度:±10%;额定电压:50V;材质(温度系数):X5R;; LCSC Part Name: 10uF ±10% 50V; Supplier Part: C13585; Manufacturer: SAMSUNG(三星); Supplier Footprint: 1206; JLCPCB Part Class: 基础库; Datasheet: https://atta.szlcsc.com/upload/public/pdf/source/20160103/1457707668742.pdf; Supplier: LCSC; Tolerance: ±10%; Voltage Rated: 50V; Temperature Coefficient: X5R
C2 = 0603B104K500NT: 容值:100nF;精度:±10%;额定电压:50V;材质(温度系数):X7R;; LCSC Part Name: 100nF ±10% 50V; Supplier Part: C30926; Manufacturer: FH(风华); Supplier Footprint: 0603; JLCPCB Part Class: 扩展库; Datasheet: https://atta.szlcsc.com/upload/public/pdf/source/20170923/C30926_1506149436298988724.pdf; Supplier: LCSC; Tolerance: ±10%; Voltage Rated: 50V; Temperature Coefficient: X7R
C4 = 0603B104K500NT: 容值:100nF;精度:±10%;额定电压:50V;材质(温度系数):X7R;; LCSC Part Name: 100nF ±10% 50V; Supplier Part: C30926; Manufacturer: FH(风华); Supplier Footprint: 0603; JLCPCB Part Class: 扩展库; Datasheet: https://atta.szlcsc.com/upload/public/pdf/source/20200305/C486355_26A10D38EF8C2A5C37091D0039909270.pdf; Supplier: LCSC; Tolerance: ±10%; Voltage Rated: 50V; Temperature Coefficient: X7R
U4 = CH340E: 应用功能:收发器;接口协议:USB 2.0;数据速率:2Mbps;; LCSC Part Name: USB转串口芯片 CH340; Supplier Part: C99652; Manufacturer: WCH(南京沁恒); Supplier Footprint: MSOP-10; JLCPCB Part Class: 扩展库; Datasheet: https://atta.szlcsc.com/upload/public/pdf/source/20230530/6E401E9554E9F5311886CC8B3F89B62E.pdf; Supplier: LCSC; Applications Function: 收发器; Protocol: USB 2.0; Data Rate: 2Mbps; Supply Voltage: 3.3V；5V
USB1 = TYPE-C 16PIN 2MD(073): 连接器类型:Type-C;标准:-;公母:母;触点数量:16P;端口数量:1;安装方式:卧贴;额定电流 - 电源:5A;工作温度范围:-25℃~+85℃;; LCSC Part Name: Type-C 母 卧贴 带定位柱 不锈钢外壳 2次模顶; Supplier Part: C2765186; Manufacturer: SHOU HAN(首韩); Supplier Footprint: SMD; JLCPCB Part Class: 扩展库; Datasheet: https://atta.szlcsc.com/upload/public/pdf/source/20211123/39B17C16241EAC15C5E277BDA434118E.pdf; Supplier: LCSC; Connector Type: Type-C; Gender: 母; Number of Contacts: 16P; Number of Ports: 1; Mounting Style: 卧贴; Current Rating - Power (Max): 5A; Operating Temperature Range: -25℃~+85℃

## Nets
GND: C1.1 C2.2 C4.2 U4.3(GND) USB1.1(GND) USB1.12(GND) USB1.13(SHELL) USB1.14(SHELL)
VBUS: C1.2 C2.1 U4.7(VCC) USB1.2(VBUS) USB1.11(VBUS)
USB_TTL_CTS: U4.5(CTS#)
USB_TTL_RTS: U4.4(RTS#)
USB_TTL_RX: U4.9(RXD)
USB_TTL_TX: U4.8(TXD)
Net-(C4-1): C4.1 U4.10(V3)
Net-(U4-1): U4.1(UD+) USB1.6(DP1)
Net-(U4-2): U4.2(UD-) USB1.7(DN1)

Not connected (* = marked no-connect by the designer): U4 6(TNOW)*; USB1 3(SBU2)* 4(CC1)* 5(DN2)* 8(DP2)* 9(SBU1)* 10(CC2)*

# Board CH340GV1
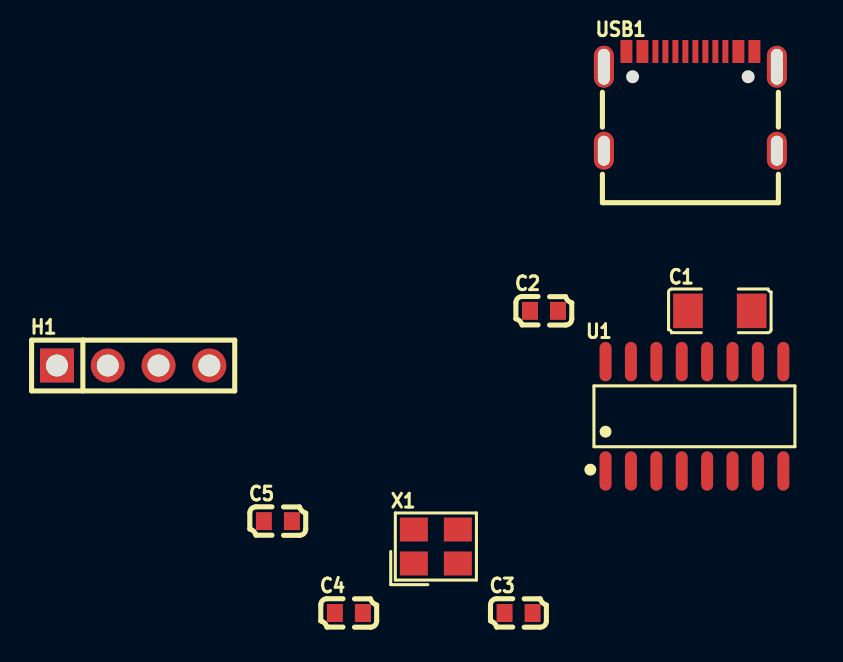
[diagram p4: board, top side]
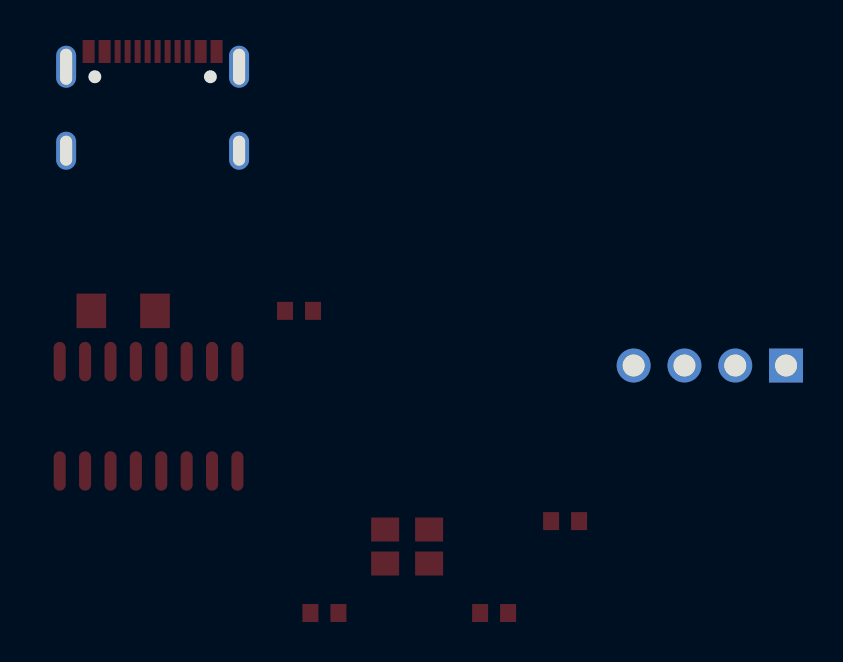
[diagram p5: board, bottom side, seen from below]

Outline 6.42 x 0.64 mm; copper layers: Top Layer, Bottom Layer. Coordinates in mm from the lower left corner of the outline.
Stack: Top Layer 0.035mm / Dielectric1 1.51mm FR4 er 4.5 / Bottom Layer 0.035mm

## Design rules (mm)
template: JLCPCB Capability(Two Layers Board)
spacing copperThickness1oz (default): track to track 0.102, other pairs 0.152 to 0.3
spacing copperThickness2oz: track to track 0.203, other pairs 0.152 to 0.3
track width copperThickness1oz (default): min 0.127, default 0.254, max 2.54
track width copperThickness2oz: min 0.203, default 0.254, max 2.54
differential pair differentialPair (default): width min 0.127, default 0.254, max 2.54; gap min 0.152, default 0.152
via viaSize (default): diameter min 0.5, default 0.61, max 10; hole min 0.3, default 0.305, max 6.3

## Placement (name value [footprint] x y rotation side)
C1  10uF  [C1206]  4.68 -11.39 0 top
C2  100nF  [C0603]  -4.11 -11.39 0 top
C3  22pF  [C0603]  -5.38 -26.5 0 top
C4  22pF  [C0603]  -13.87 -26.5 0 top
C5  100nF  [C0603]  -17.42 -21.9 0 top
H1  PZ254V-11-04P  [HDR-TH_4P-P2.54-V-M]  -24.66 -14.12 0 top
U1  CH340G  [SOIC-16_L9.9-W3.9-P1.27-LS6.0-BL]  3.41 -16.66 0 top
USB1  TYPEC-304J-BCP16  [USB-C-SMD_TYPEC-304J-BCP16]  3.21 -0.9 0 top
X1  12MHz  [CRYSTAL-SMD_4P-L3.2-W2.5-BL]  -9.52 -23.17 0 top

## Footprints (pads in the part's own frame, mm; a bottom-side part is the same pattern mirrored in y, then rotated)
C0603
  rect 0.8x0.9 smd: 1(-0.7,0) 2(0.7,0)
C1206
  rect 1.485x1.728 smd: 1(-1.593,0) 2(1.593,0)
CRYSTAL-SMD_4P-L3.2-W2.5-BL
  rect 1.4x1.2 smd: 1(-1.1,-0.85) 2(1.1,-0.85) 3(1.1,0.85) 4(-1.1,0.85)
HDR-TH_4P-P2.54-V-M
  rect 1.7x1.7 hole 1.1: 1(-3.81,0)
  round 1.7 hole 1.1: 2(-1.27,0) 3(1.27,0) 4(3.81,0)
SOIC-16_L9.9-W3.9-P1.27-LS6.0-BL
  oval 0.602x1.971 smd: 1(-4.445,-2.736) 2(-3.175,-2.736) 3(-1.905,-2.736) 4(-0.635,-2.736) 5(0.635,-2.736) 6(1.905,-2.736) 7(3.175,-2.736) 8(4.445,-2.736) 9(4.445,2.736) 10(3.175,2.736) 11(1.905,2.736) 12(0.635,2.736) 13(-0.635,2.736) 14(-1.905,2.736) 15(-3.175,2.736) 16(-4.445,2.736)
USB-C-SMD_TYPEC-304J-BCP16
  oval 1x2.1 hole 0.6x1.8: 13(-4.325,1.718) 14(4.325,1.718)
  oval 1x1.9 hole 0.6x1.5: 15(-4.325,-2.482) 16(4.325,-2.482)
  rect 0.6x1.15 smd: A1B12(-3.2,2.482) A4B9(-2.4,2.482) B1A12(3.2,2.482) B4A9(2.4,2.482)
  rect 0.3x1.15 smd: A5(-1.25,2.482) A6(-0.25,2.482) A7(0.25,2.482) A8(1.25,2.482) B5(1.75,2.482) B6(0.75,2.482) B7(-0.75,2.482) B8(-1.75,2.482)

## Nets
As in the schematic.

Pads without a net: U1 9 10 11 12 13 14 15; USB1 A5 A8 B4A9 B5 B6 B7 B8

# Board CH340G3
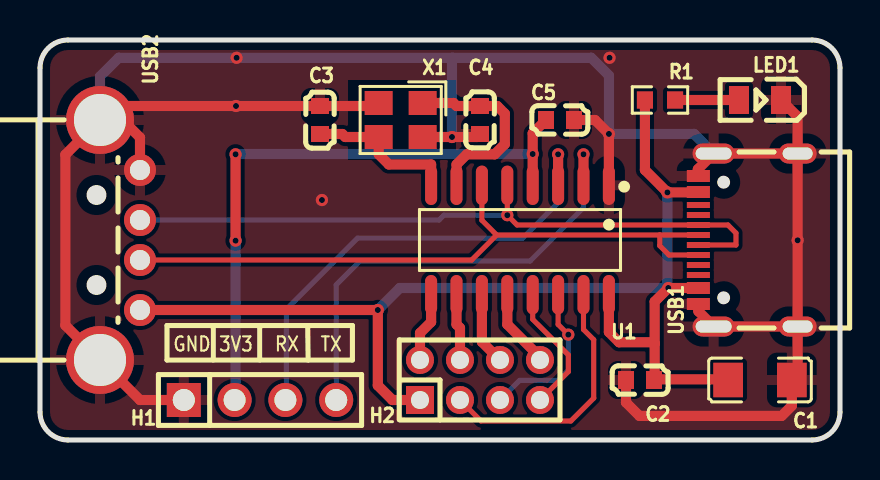
[diagram p6: board, top side]
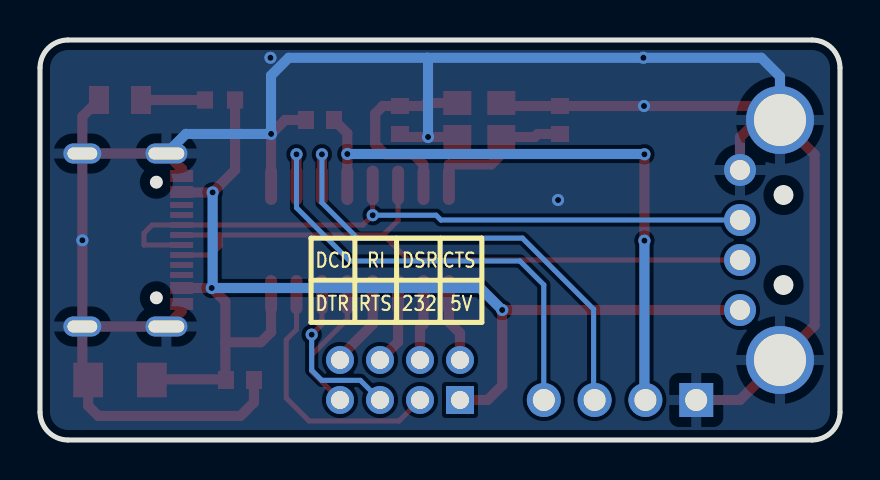
[diagram p7: board, bottom side, seen from below]

Outline 40 x 20 mm; copper layers: Top Layer, Bottom Layer. Coordinates in mm from the lower left corner of the outline.
Outline path: 0,18.6 0,1.4 arc(0.41,0.41) 1.4,0 38.6,0 arc(39.59,0.41) 40,1.4 40,18.6 arc(39.59,19.59) 38.6,20 1.4,20 arc(0.41,19.59) 0,18.6
Stack: Top Layer 0.035mm / Dielectric1 1.51mm FR4 er 4.5 / Bottom Layer 0.035mm

## Design rules (mm)
template: JLCPCB Capability(Two Layers Board)
spacing copperThickness1oz (default): track to track 0.102, other pairs 0.152 to 0.3
spacing copperThickness2oz: track to track 0.203, other pairs 0.152 to 0.3
track width copperThickness1oz (default): min 0.127, default 0.254, max 2.54
track width copperThickness2oz: min 0.203, default 0.254, max 2.54
differential pair differentialPair (default): width min 0.127, default 0.254, max 2.54; gap min 0.152, default 0.152
via viaSize (default): diameter min 0.5, default 0.61, max 10; hole min 0.3, default 0.305, max 6.3

## Placement (name value [footprint] x y rotation side)
C1  10uF  [C1206]  36 3 180 top
C2  100nF  [C0603]  30 3 180 top
C3  22pF  [C0603]  14 16 90 top
C4  22pF  [C0603]  22 16 270 top
C5  100nF  [C0603]  26 16 0 top
H1  PZ254V-11-04P  [HDR-TH_4P-P2.54-V-M]  11 2 0 top
H2  PZ200-2-04-Z  [HDR-TH_8P-P2.00-V-M-R2-C4-S2.00]  22 3 0 top
LED1  NCD0805R1  [LED0805-R-RD]  36 17 180 top
R1  1kΩ  [R0603]  31 17 180 top
U1  CH340G  [SOIC-16_L9.9-W3.9-P1.27-LS6.0-BL]  24 10 180 top
USB1  TYPEC-304J-BCP16  [USB-C-SMD_TYPEC-304J-BCP16]  35.4 10 90 top
USB2  AM90  [USB-AM-TH_AM90]  4 10 270 top
X1  12MHz  [CRYSTAL-SMD_4P-L3.2-W2.5-BL]  18.03 16 180 top

## Footprints (pads in the part's own frame, mm; a bottom-side part is the same pattern mirrored in y, then rotated)
C0603
  rect 0.8x0.9 smd: 1(-0.7,0) 2(0.7,0)
C1206
  rect 1.485x1.728 smd: 1(-1.593,0) 2(1.593,0)
CRYSTAL-SMD_4P-L3.2-W2.5-BL
  rect 1.4x1.2 smd: 1(-1.1,-0.85) 2(1.1,-0.85) 3(1.1,0.85) 4(-1.1,0.85)
HDR-TH_4P-P2.54-V-M
  rect 1.7x1.7 hole 1.1: 1(-3.81,0)
  round 1.7 hole 1.1: 2(-1.27,0) 3(1.27,0) 4(3.81,0)
HDR-TH_8P-P2.00-V-M-R2-C4-S2.00
  rect 1.4x1.4 hole 0.9: 1(-3,-1)
  round 1.4 hole 0.9: 2(-3,1) 3(-1,-1) 4(-1,1) 5(1,-1) 6(1,1) 7(3,-1) 8(3,1)
LED0805-R-RD
  rect 1x1.399 smd: 1(1.05,0) 2(-1.05,0)
R0603
  rect 0.806x0.864 smd: 1(-0.753,0) 2(0.753,0)
SOIC-16_L9.9-W3.9-P1.27-LS6.0-BL
  oval 0.602x1.971 smd: 1(-4.445,-2.736) 2(-3.175,-2.736) 3(-1.905,-2.736) 4(-0.635,-2.736) 5(0.635,-2.736) 6(1.905,-2.736) 7(3.175,-2.736) 8(4.445,-2.736) 9(4.445,2.736) 10(3.175,2.736) 11(1.905,2.736) 12(0.635,2.736) 13(-0.635,2.736) 14(-1.905,2.736) 15(-3.175,2.736) 16(-4.445,2.736)
USB-AM-TH_AM90
  round 1.6 hole 1: 1(3.5,1) 2(1,1) 3(-1,1) 4(-3.5,1)
  round 3.4 hole 2.6: MH1(6,-1) MH2(-6,-1)
USB-C-SMD_TYPEC-304J-BCP16
  oval 1x2.1 hole 0.6x1.8: 13(-4.325,1.718) 14(4.325,1.718)
  oval 1x1.9 hole 0.6x1.5: 15(-4.325,-2.482) 16(4.325,-2.482)
  rect 0.6x1.15 smd: A1B12(-3.2,2.482) A4B9(-2.4,2.482) B1A12(3.2,2.482) B4A9(2.4,2.482)
  rect 0.3x1.15 smd: A5(-1.25,2.482) A6(-0.25,2.482) A7(0.25,2.482) A8(1.25,2.482) B5(1.75,2.482) B6(0.75,2.482) B7(-0.75,2.482) B8(-1.75,2.482)

## Nets
As in the schematic.

Pads without a net: USB1 A5 A8 B5 B8

## Via types
v1: diameter 0.61, hole 0.305, Top Layer to Bottom Layer, 17 vias

## Routing (per net, layer and track width the routed paths; a pad name or vN(x,y) marks a point on that pad's centre or on a via; arc(x,y) is an arc through that point)
3V3: length 30.7
  Top Layer w0.508: U1.4 v1(24.63,14.3) 24.63,15.33 C5.1 ; v1(9.78,9.97) v1(9.78,14.28)
  Bottom Layer w0.508: v1(9.78,14.28) 9.79,14.3 v1(24.63,14.3) ; v1(9.78,9.97) 9.78,2.05 H1.2
GND: length 122.1
  Top Layer w0.508: USB2.4 5,15.13 4.13,16 USB2.MH2 ; X1.2 16.78,16.7 C3.2 3.7,16.7 USB2.MH2 ; LED1.2 37.88,16.17 USB1.16 ; X1.4 v1(20.6,15.15) 21.85,15.15 C4.2 ; USB1.15 v1(37.88,9.99) USB1.16 ; USB1.15 USB1.13 32.92,6.44 USB1.A1B12 ; USB1.15 37.88,3.29 C1.1 37.59,1.71 37.08,1.2 29.97,1.2 29.3,1.88 C2.2 ; USB2.MH2 1.27,14.27 1.27,5.73 USB2.MH1 5,2 H1.1 ; C5.2 27.75,16 v1(28.44,15.3) U1.1 ; USB1.16 USB1.14 32.89,13.54 32.89,13.23 USB1.B1A12
  Bottom Layer w0.508: USB1.14 32.7,15.3 v1(28.44,15.3) 28.45,15.31 28.45,18.22 27.56,19.11 20.64,19.11 ; USB2.MH2 3,18.17 3.94,19.11 v1(9.83,19.11) 20.64,19.11 ; 20.64,19.11 20.6,19.07 v1(20.6,15.15)
  vias: v1(9.8,16.7) v1(14.1,12) v1(28.48,19.11)
VBUS: length 59
  Top Layer w0.508: 30.73,4.83 30.73,6.92 v1(31.41,7.6) USB1.A4B9 ; 30.73,4.83 30.68,4.89 28.96,4.89 28.44,5.4 U1.16 ; 30.73,4.83 30.73,3.03 ; C1.2 34.37,3.03 30.73,3.03 ; USB2.1 v1(16.89,6.5) 16.89,2.73 17.62,2 H2.1 ; USB1.B4A9 32.9,12.38 v1(31.37,12.38) 30.25,13.5 R1.2 ; 30.73,3.03 C2.1
  Bottom Layer w0.508: v1(31.37,12.38) 31.37,7.65 v1(31.41,7.6) 17.99,7.6 v1(16.89,6.5)
CTS: length 3.5
  Top Layer w0.508: U1.9 19.56,5.9 19,5.34 H2.2
DCD: length 3.9
  Top Layer w0.508: H2.8 25,4.14 23.37,5.78 U1.12
DSR: length 3.3
  Top Layer w0.508: U1.10 20.82,5.78 21,5.6 H2.4
DTR: length 6.6
  Top Layer w0.254: H2.7 26.42,3.42 26.42,4.25 24.63,6.03 U1.13
R232: length 13
  Top Layer w0.254: U1.15 27.18,5.53 27.69,5.01 27.69,2.09 26.54,0.95 22.05,0.95 H2.3
RI: length 3.6
  Top Layer w0.508: U1.11 22.09,4.91 H2.6
RTS: length 8
  Top Layer w0.254: v1(26.42,5.27) 25.91,5.78 U1.14
  Bottom Layer w0.254: v1(26.42,5.27) 26.42,3.49 25.91,2.98 23.98,2.98 H2.5
RX: length 24.3
  Top Layer w0.508: U1.3 v1(25.91,14.28)
  Bottom Layer w0.254: v1(25.91,14.28) 25.91,11.87 24.13,10.09 15.88,10.09 12.32,6.54 12.32,2.05 H1.3
TX: length 23.9
  Top Layer w0.508: U1.2 v1(27.18,14.28)
  Bottom Layer w0.254: v1(27.18,14.28) 27.18,11.61 24.51,8.95 16,8.95 14.81,7.76 H1.4
USB_D+: length 34.2
  Top Layer w0.254: U1.5 v1(23.37,11.24) 23.85,10.75 USB1.B6 34.4,10.75 34.8,10.35 34.8,9.75 USB1.A6
  Bottom Layer w0.254: USB2.3 19.96,11 20.2,11.24 v1(23.37,11.24)
USB_D-: length 33.9
  Top Layer w0.254: 22.83,10.25 30.99,10.25 ; 22.83,10.25 21.58,9 USB2.2 ; 22.83,10.25 22.09,10.99 U1.6 ; 30.99,10.25 USB1.A7 ; 30.99,10.25 30.99,9.71 31.45,9.25 USB1.B7
XI: length 9.7
  Top Layer w0.508: X1.1 20.68,16.85 20.83,16.7 C4.1 22.86,16.7 23.24,16.32 23.24,14.79 22.73,14.28 21.34,14.28 20.83,13.78 20.83,12.74 U1.7
XO: length 7.7
  Top Layer w0.508: C3.1 15.11,15.3 15.26,15.15 X1.3 16.93,14.28 17.44,13.78 19.56,13.78 U1.8
$1N1485: length 3.2
  Top Layer w0.508: LED1.1 R1.1

## Copper pours and planes (outline as drawn; the poured copper is in the pictures)
GND on Top Layer: 0,20 40,20 40,0 0,0
GND on Bottom Layer: 0,20 40,20 40,0 0,0

## Text on the board
Bottom Silkscreen Layer: 5V | CTS | DSR | 232 | RI | RTS | DCD | DTR
Top Silkscreen Layer: GND | 3V3 | RX | TX
